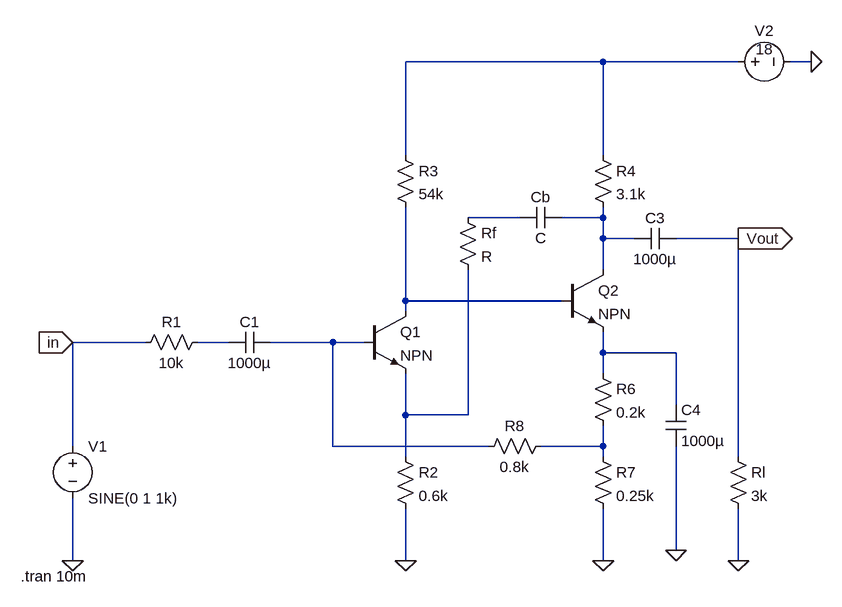
[diagram p0: schematic project draft.asc]
project draft.asc, the LTspice schematic file:
Version 4
SHEET 1 1208 680
WIRE 864 -480 560 -480
WIRE 1072 -480 864 -480
WIRE 1184 -480 1152 -480
WIRE 560 -336 560 -480
WIRE 864 -336 864 -480
WIRE 736 -240 656 -240
WIRE 864 -240 864 -256
WIRE 864 -240 800 -240
WIRE 864 -208 864 -240
WIRE 912 -208 864 -208
WIRE 1072 -208 976 -208
WIRE 864 -160 864 -208
WIRE 560 -112 560 -256
WIRE 800 -112 560 -112
WIRE 560 -96 560 -112
WIRE 160 -48 48 -48
WIRE 288 -48 240 -48
WIRE 448 -48 352 -48
WIRE 496 -48 448 -48
WIRE 864 -32 864 -64
WIRE 976 -32 864 -32
WIRE 864 0 864 -32
WIRE 976 48 976 -32
WIRE 560 64 560 0
WIRE 656 64 656 -160
WIRE 656 64 560 64
WIRE 48 112 48 -48
WIRE 448 112 448 -48
WIRE 688 112 448 112
WIRE 864 112 864 80
WIRE 864 112 768 112
WIRE 560 128 560 64
WIRE 864 128 864 112
WIRE 1072 128 1072 -208
WIRE 976 272 976 112
WIRE 48 288 48 192
WIRE 560 288 560 208
WIRE 864 288 864 208
WIRE 1072 288 1072 208
FLAG 48 288 0
FLAG 560 288 0
FLAG 1072 288 0
FLAG 1184 -480 0
FLAG 864 288 0
FLAG 1072 -208 Vout
IOPIN 1072 -208 Out
FLAG 976 272 0
FLAG 48 -48 in
IOPIN 48 -48 In
SYMBOL voltage 48 96 R0
WINDOW 123 0 0 Left 0
WINDOW 39 0 0 Left 0
SYMATTR InstName V1
SYMATTR Value SINE(0 1 1k)
SYMBOL cap 352 -64 R90
WINDOW 0 0 32 VBottom 2
WINDOW 3 32 32 VTop 2
SYMATTR InstName C1
SYMATTR Value 1000µ
SYMBOL res 256 -64 R90
WINDOW 0 0 56 VBottom 2
WINDOW 3 32 56 VTop 2
SYMATTR InstName R1
SYMATTR Value 10k
SYMBOL npn 496 -96 R0
SYMATTR InstName Q1
SYMBOL res 544 112 R0
SYMATTR InstName R2
SYMATTR Value 0.6k
SYMBOL cap 976 -224 R90
WINDOW 0 0 32 VBottom 2
WINDOW 3 32 32 VTop 2
SYMATTR InstName C3
SYMATTR Value 1000µ
SYMBOL npn 800 -160 R0
SYMATTR InstName Q2
SYMBOL res 544 -352 R0
SYMATTR InstName R3
SYMATTR Value 54k
SYMBOL res 848 -352 R0
SYMATTR InstName R4
SYMATTR Value 3.1k
SYMBOL res 1056 112 R0
SYMATTR InstName Rl
SYMATTR Value 3k
SYMBOL voltage 1056 -480 R270
WINDOW 0 32 56 VTop 2
WINDOW 3 4 56 VTop 2
WINDOW 123 0 0 Left 0
WINDOW 39 0 0 Left 0
SYMATTR InstName V2
SYMATTR Value 18
SYMBOL res 848 -16 R0
SYMATTR InstName R6
SYMATTR Value 0.2k
SYMBOL res 848 112 R0
SYMATTR InstName R7
SYMATTR Value 0.25k
SYMBOL res 784 96 R90
WINDOW 0 0 56 VBottom 2
WINDOW 3 32 56 VTop 2
SYMATTR InstName R8
SYMATTR Value 0.8k
SYMBOL cap 960 48 R0
SYMATTR InstName C4
SYMATTR Value 1000µ
SYMBOL res 640 -256 R0
SYMATTR InstName Rf
SYMBOL cap 800 -256 R90
WINDOW 0 0 32 VBottom 2
WINDOW 3 32 32 VTop 2
SYMATTR InstName Cb
TEXT -32 312 Left 2 !.tran 10m

The netlist it stands for:
* project draft.asc
V1 in 0 SINE(0 1 1k)
C1 N006 N005 1000µ
R1 N005 in 10k
Q1 N004 N006 N008 0 NPN
R2 N008 0 0.6k
C3 Vout N003 1000µ
Q2 N003 N004 N007 0 NPN
R3 N001 N004 54k
R4 N001 N003 3.1k
Rl Vout 0 3k
V2 N001 0 18
R6 N007 N009 0.2k
R7 N009 0 0.25k
R8 N009 N006 0.8k
C4 N007 0 1000µ
Rf N002 N008 R
Cb N003 N002 C
.model NPN NPN
.model PNP PNP
.lib standard.bjt
.tran 10m
.backanno
.end